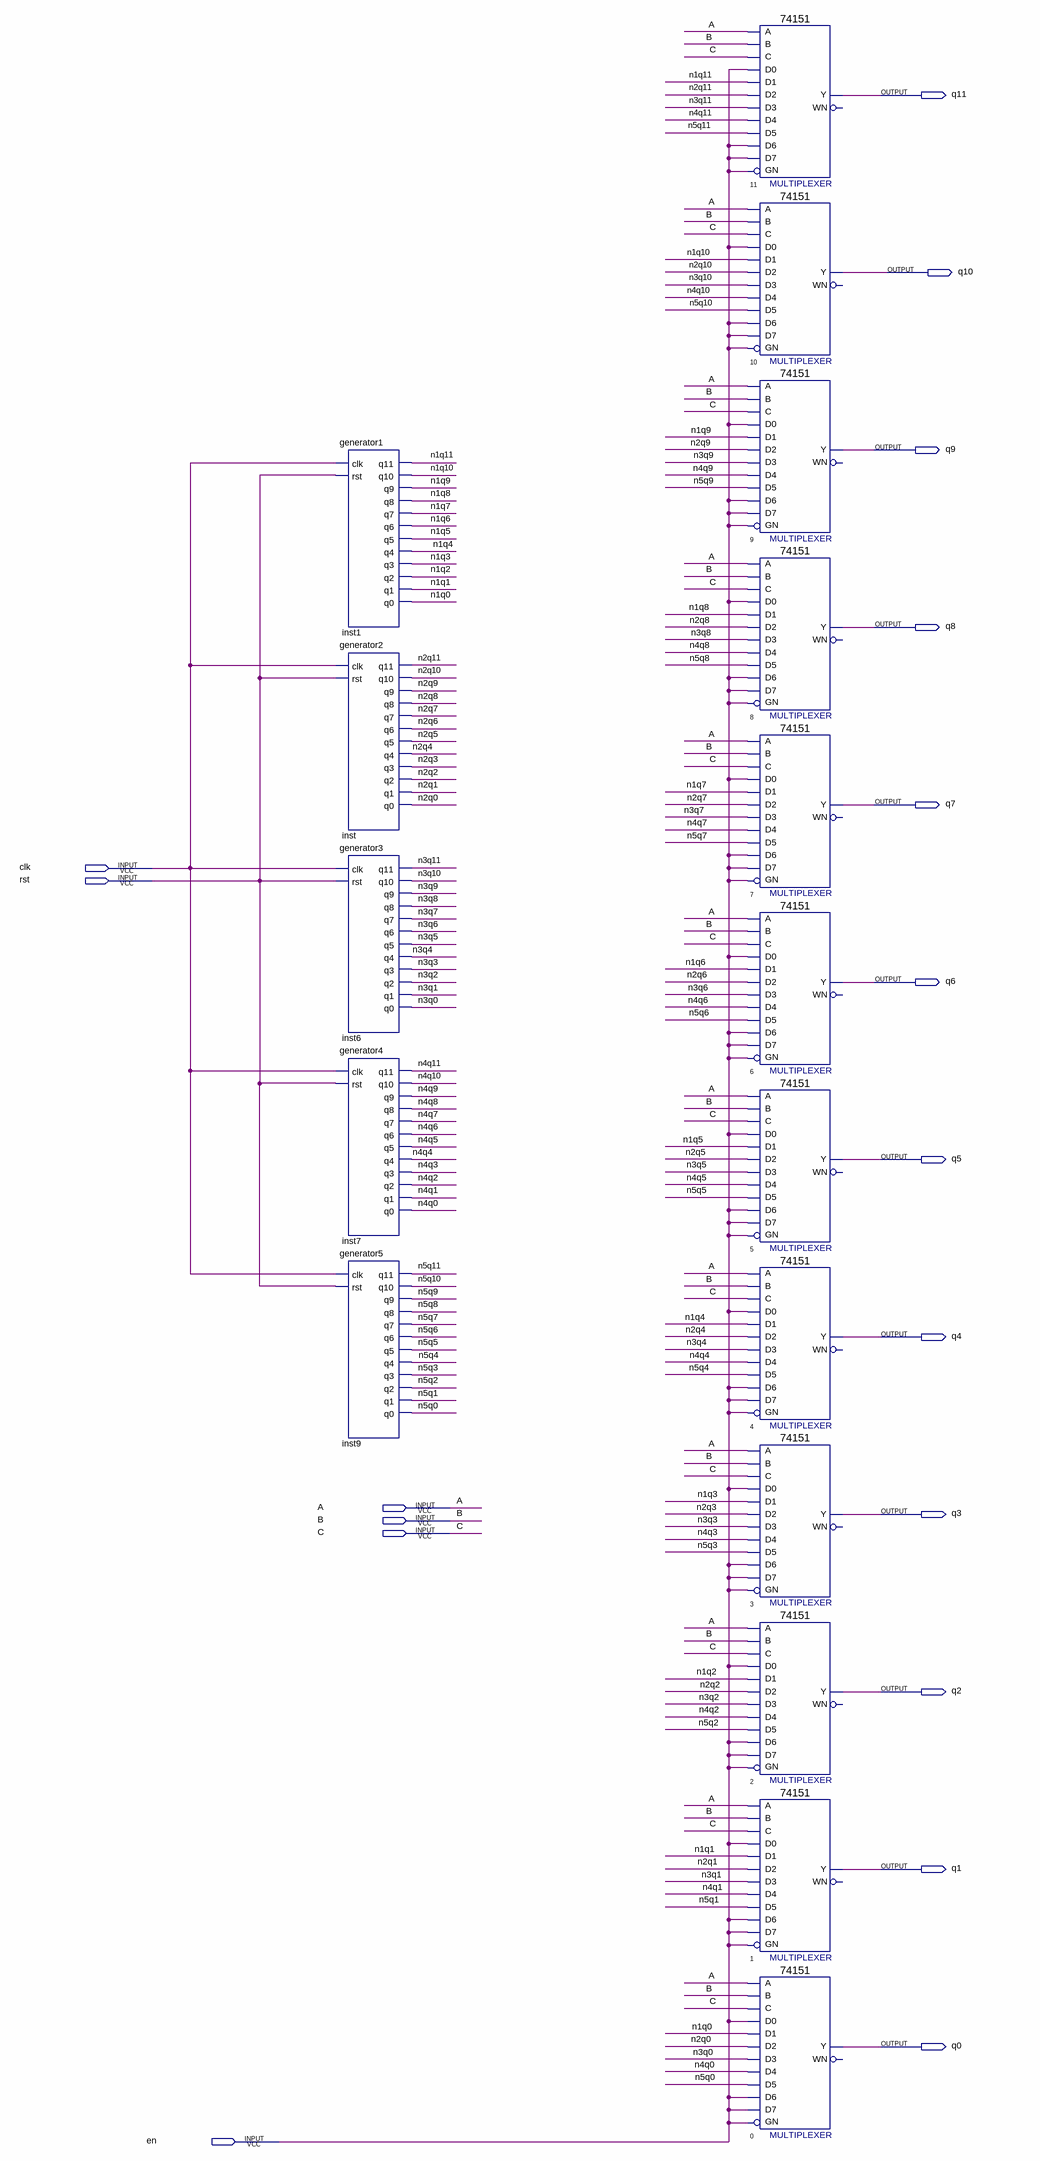
[diagram p0: schematic sheet]
// Quartus schematic wavechoice.bdf as structural Verilog: 17 symbols, 18 pins
module wavechoice (
  input  clk,
  input  rst,
  input  A,
  input  B,
  input  C,
  input  en,
  output q11,
  output q10,
  output q9,
  output q8,
  output q7,
  output q6,
  output q5,
  output q4,
  output q3,
  output q2,
  output q1,
  output q0
);

  wire n1q0, n1q1, n1q2, n1q3, n1q4, n1q5, n1q6, n1q7, n1q8, n1q9, n1q10, n1q11, n2q0, n2q1, n2q2, n2q3,
       n2q4, n2q5, n2q6, n2q7, n2q8, n2q9, n2q10, n2q11, n3q0, n3q1, n3q2, n3q3, n3q4, n3q5, n3q6, n3q7,
       n3q8, n3q9, n3q10, n3q11, n4q0, n4q1, n4q2, n4q3, n4q4, n4q5, n4q6, n4q7, n4q8, n4q9, n4q10, n4q11,
       n5q0, n5q1, n5q2, n5q3, n5q4, n5q5, n5q6, n5q7, n5q8, n5q9, n5q10, n5q11;

  generator1 inst1 (
    .clk(clk), .rst(rst), .q11(n1q11), .q10(n1q10), .q9(n1q9), .q8(n1q8), .q7(n1q7), .q6(n1q6), .q5(n1q5),
    .q4(n1q4), .q3(n1q3), .q2(n1q2), .q1(n1q1), .q0(n1q0));
  generator2 inst (
    .clk(clk), .rst(rst), .q11(n2q11), .q10(n2q10), .q9(n2q9), .q8(n2q8), .q7(n2q7), .q6(n2q6), .q5(n2q5),
    .q4(n2q4), .q3(n2q3), .q2(n2q2), .q1(n2q1), .q0(n2q0));
  generator3 inst6 (
    .clk(clk), .rst(rst), .q11(n3q11), .q10(n3q10), .q9(n3q9), .q8(n3q8), .q7(n3q7), .q6(n3q6), .q5(n3q5),
    .q4(n3q4), .q3(n3q3), .q2(n3q2), .q1(n3q1), .q0(n3q0));
  generator4 inst7 (
    .clk(clk), .rst(rst), .q11(n4q11), .q10(n4q10), .q9(n4q9), .q8(n4q8), .q7(n4q7), .q6(n4q6), .q5(n4q5),
    .q4(n4q4), .q3(n4q3), .q2(n4q2), .q1(n4q1), .q0(n4q0));
  generator5 inst9 (
    .clk(clk), .rst(rst), .q11(n5q11), .q10(n5q10), .q9(n5q9), .q8(n5q8), .q7(n5q7), .q6(n5q6), .q5(n5q5),
    .q4(n5q4), .q3(n5q3), .q2(n5q2), .q1(n5q1), .q0(n5q0));
  \74151  u_11 (
    .GN(en), .C(C), .B(B), .A(A), .D5(n5q11), .D0(en), .D1(n1q11), .D4(n4q11), .D3(n3q11), .D2(n2q11),
    .D6(en), .D7(en), .Y(q11));  // open: WN
  \74151  u_10 (
    .GN(en), .C(C), .B(B), .A(A), .D5(n5q10), .D0(en), .D1(n1q10), .D4(n4q10), .D3(n3q10), .D2(n2q10),
    .D6(en), .D7(en), .Y(q10));  // open: WN
  \74151  u_9 (
    .GN(en), .C(C), .B(B), .A(A), .D5(n5q9), .D0(en), .D1(n1q9), .D4(n4q9), .D3(n3q9), .D2(n2q9), .D6(en),
    .D7(en), .Y(q9));  // open: WN
  \74151  u_8 (
    .GN(en), .C(C), .B(B), .A(A), .D5(n5q8), .D0(en), .D1(n1q8), .D4(n4q8), .D3(n3q8), .D2(n2q8), .D6(en),
    .D7(en), .Y(q8));  // open: WN
  \74151  u_7 (
    .GN(en), .C(C), .B(B), .A(A), .D5(n5q7), .D0(en), .D1(n1q7), .D4(n4q7), .D3(n3q7), .D2(n2q7), .D6(en),
    .D7(en), .Y(q7));  // open: WN
  \74151  u_6 (
    .GN(en), .C(C), .B(B), .A(A), .D5(n5q6), .D0(en), .D1(n1q6), .D4(n4q6), .D3(n3q6), .D2(n2q6), .D6(en),
    .D7(en), .Y(q6));  // open: WN
  \74151  u_5 (
    .GN(en), .C(C), .B(B), .A(A), .D5(n5q5), .D0(en), .D1(n1q5), .D4(n4q5), .D3(n3q5), .D2(n2q5), .D6(en),
    .D7(en), .Y(q5));  // open: WN
  \74151  u_4 (
    .GN(en), .C(C), .B(B), .A(A), .D5(n5q4), .D0(en), .D1(n1q4), .D4(n4q4), .D3(n3q4), .D2(n2q4), .D6(en),
    .D7(en), .Y(q4));  // open: WN
  \74151  u_3 (
    .GN(en), .C(C), .B(B), .A(A), .D5(n5q3), .D0(en), .D1(n1q3), .D4(n4q3), .D3(n3q3), .D2(n2q3), .D6(en),
    .D7(en), .Y(q3));  // open: WN
  \74151  u_2 (
    .GN(en), .C(C), .B(B), .A(A), .D5(n5q2), .D0(en), .D1(n1q2), .D4(n4q2), .D3(n3q2), .D2(n2q2), .D6(en),
    .D7(en), .Y(q2));  // open: WN
  \74151  u_1 (
    .GN(en), .C(C), .B(B), .A(A), .D5(n5q1), .D0(en), .D1(n1q1), .D4(n4q1), .D3(n3q1), .D2(n2q1), .D6(en),
    .D7(en), .Y(q1));  // open: WN
  \74151  u_0 (
    .GN(en), .C(C), .B(B), .A(A), .D5(n5q0), .D0(en), .D1(n1q0), .D4(n4q0), .D3(n3q0), .D2(n2q0), .D6(en),
    .D7(en), .Y(q0));  // open: WN
endmodule
